# EAGLE design x49_ecu (EAGLE 9.3.1)
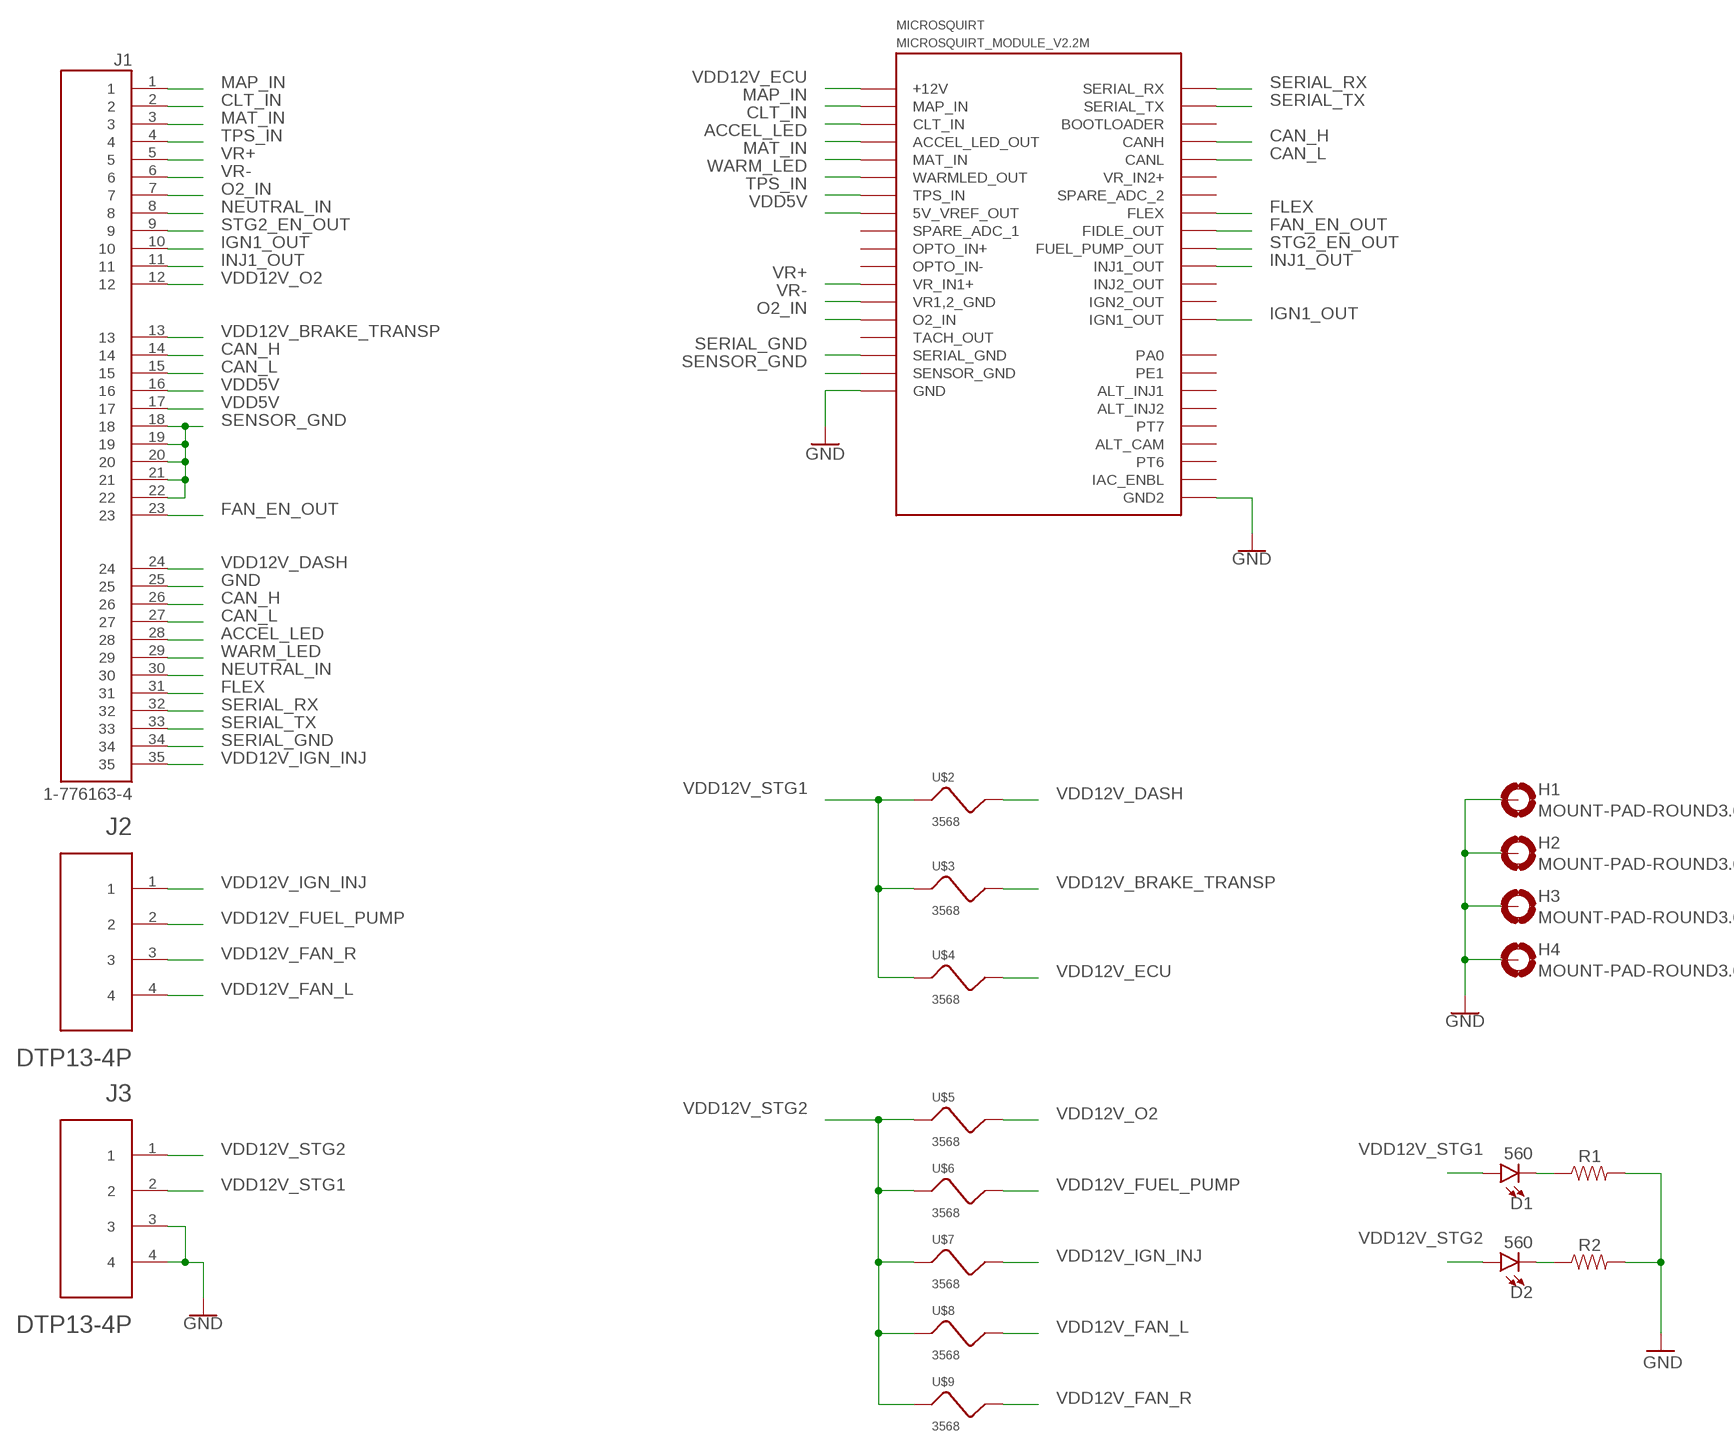
[diagram p0: schematic, sheet 1]

## Parts
D1  560  LED5MM  [LED_5MM]
D2  560  LED5MM  [LED_5MM]
H1  MOUNT-PAD-ROUND3.6  [3,6-PAD]
H2  MOUNT-PAD-ROUND3.6  [3,6-PAD]
H3  MOUNT-PAD-ROUND3.6  [3,6-PAD]
H4  MOUNT-PAD-ROUND3.6  [3,6-PAD]
J1  1-776163-4  [TE_1-776163-4]
J2  DTP13-4P  [TE_DTP13-4P]
J3  DTP13-4P  [TE_DTP13-4P]
MICROSQUIRT  MICROSQUIRT_MODULE_V2.2M  [MICROSQUIRT_MODULE_V2.2M]
R1  RESISTORAXIAL-0.3  [AXIAL-0.3]
R2  RESISTORAXIAL-0.3  [AXIAL-0.3]
U$2  3568  [3568]
U$3  3568  [3568]
U$4  3568  [3568]
U$5  3568  [3568]
U$6  3568  [3568]
U$7  3568  [3568]
U$8  3568  [3568]
U$9  3568  [3568]

## Nets
ACCEL_LED: J1.28 MICROSQUIRT.ACCEL_LED_OUT
CAN_H: J1.14 J1.26 MICROSQUIRT.CANH
CAN_L: J1.15 J1.27 MICROSQUIRT.CANL
CLT_IN: J1.2 MICROSQUIRT.CLT_IN
FAN_EN_OUT: J1.23 MICROSQUIRT.FIDLE_OUT
FLEX: J1.31 MICROSQUIRT.FLEX
GND: H1.B3,6(MOUNT) H2.B3,6(MOUNT) H3.B3,6(MOUNT) H4.B3,6(MOUNT) J1.25 J3.3 J3.4 MICROSQUIRT.GND1_1(GND) MICROSQUIRT.GND1_2(GND) MICROSQUIRT.GND1_3(GND) MICROSQUIRT.GND1_4(GND) MICROSQUIRT.GND1_5(GND) MICROSQUIRT.GND1_6(GND) MICROSQUIRT.GND1_7(GND) MICROSQUIRT.GND1_8(GND) MICROSQUIRT.GND2_1(GND2) MICROSQUIRT.GND2_2(GND2) R1.P$2 R2.P$2
IGN1_OUT: J1.10 MICROSQUIRT.IGN1_OUT_1(IGN1_OUT) MICROSQUIRT.IGN1_OUT_2(IGN1_OUT)
INJ1_OUT: J1.11 MICROSQUIRT.INJ1_OUT_1(INJ1_OUT) MICROSQUIRT.INJ1_OUT_2(INJ1_OUT) MICROSQUIRT.INJ1_OUT_3(INJ1_OUT) MICROSQUIRT.INJ1_OUT_4(INJ1_OUT) MICROSQUIRT.INJ1_OUT_5(INJ1_OUT)
MAP_IN: J1.1 MICROSQUIRT.MAP_IN
MAT_IN: J1.3 MICROSQUIRT.MAT_IN
N$1: D1.K(C) R1.P$1
N$2: D2.K(C) R2.P$1
NEUTRAL_IN: J1.8 J1.30
O2_IN: J1.7 MICROSQUIRT.O2_IN
SENSOR_GND: J1.18 J1.19 J1.20 J1.21 J1.22 MICROSQUIRT.SENSOR_GND
SERIAL_GND: J1.34 MICROSQUIRT.SERIAL_GND
SERIAL_RX: J1.32 MICROSQUIRT.SERIAL_RX
SERIAL_TX: J1.33 MICROSQUIRT.SERIAL_TX
STG2_EN_OUT: J1.9 MICROSQUIRT.FUEL_PUMP_OUT
TPS_IN: J1.4 MICROSQUIRT.TPS_IN
VDD5V: J1.16 J1.17 MICROSQUIRT.5V_VREF_OUT
VDD12V_BRAKE_TRANSP [PWR]: J1.13 U$3.R_1 U$3.R_2
VDD12V_DASH [PWR]: J1.24 U$2.R_1 U$2.R_2
VDD12V_ECU: MICROSQUIRT.+12V_1(+12V) MICROSQUIRT.+12V_2(+12V) U$4.R_1 U$4.R_2
VDD12V_FAN_L: J2.4 U$8.R_1 U$8.R_2
VDD12V_FAN_R: J2.3 U$9.R_1 U$9.R_2
VDD12V_FUEL_PUMP [PWR]: J2.2 U$6.R_1 U$6.R_2
VDD12V_IGN_INJ [PWR]: J1.35 J2.1 U$7.R_1 U$7.R_2
VDD12V_O2 [PWR]: J1.12 U$5.R_1 U$5.R_2
VDD12V_STG1 [PWR]: D1.A J3.2 U$2.L_1 U$2.L_2 U$3.L_1 U$3.L_2 U$4.L_1 U$4.L_2
VDD12V_STG2 [PWR]: D2.A J3.1 U$5.L_1 U$5.L_2 U$6.L_1 U$6.L_2 U$7.L_1 U$7.L_2 U$8.L_1 U$8.L_2 U$9.L_1 U$9.L_2
VR+: J1.5 MICROSQUIRT.VR_IN1+
VR-: J1.6 MICROSQUIRT.VR1,2_GND
WARM_LED: J1.29 MICROSQUIRT.WARMLED_OUT
Unconnected: MICROSQUIRT.ALT_CAM MICROSQUIRT.ALT_INJ1 MICROSQUIRT.ALT_INJ2 MICROSQUIRT.BOOTLOADER MICROSQUIRT.IAC_ENBL MICROSQUIRT.IGN2_OUT_1(IGN2_OUT) MICROSQUIRT.IGN2_OUT_2(IGN2_OUT) MICROSQUIRT.INJ2_OUT_1(INJ2_OUT) MICROSQUIRT.INJ2_OUT_2(INJ2_OUT) MICROSQUIRT.INJ2_OUT_3(INJ2_OUT) MICROSQUIRT.INJ2_OUT_4(INJ2_OUT) MICROSQUIRT.INJ2_OUT_5(INJ2_OUT) MICROSQUIRT.OPTO_IN+ MICROSQUIRT.OPTO_IN- MICROSQUIRT.PA0 MICROSQUIRT.PE1 MICROSQUIRT.PT6 MICROSQUIRT.PT7 MICROSQUIRT.SPARE_ADC_1 MICROSQUIRT.SPARE_ADC_2 MICROSQUIRT.TACH_OUT MICROSQUIRT.VR_IN2+

## Library data of the parts
D1 D2 = SparkFun-LED:LED: LED (Generic) Standard schematic elements and footprints for 5mm, 3mm, 1206, and 0603 sized LEDs. Generic LEDs with no color specified.
H1-H4 = holes:MOUNT-PAD-ROUND: MOUNTING PAD, round
J1 = te_connectivity:1-776163-4: TE Connectivity AMPSEAL 35 POS RTANG HDR ASSY W/GASKET; COMPLIANCE: Lead free/RoHS compliant; CURRENT_RATING: Varies by Wire gauge; DATASHEET: http://www.te.com/commerce/DocumentDelivery/DDEController?Action=srchrtrv&DocNm=776163&DocType=Customer+Drawing&DocLang=English; FOOTPRINT: TE_1-776163-4; LATEST_REV_DATE: 09, March 2016; LIBRARY_REF: 1-776163-4.lbr; MANUFACTURER: TE Connectivity; PACKAGE: Panel Mount, Through Hole, Right angled; PART_DESCRIPTION: CONN HEADER 35POS R/A GOLD GRAY; PART_REV: J8; PITCH: 4mm; POS: 35; STANDARD: Manufacturer Recommendations; TE_PN: 1-776163-4; VOLTAGE_RATING: 250VAC
J2 J3 = te_connectivity:DTP13-4P: TE CONNECTIVITY Dtp Recp 4#12 Pin 90 Deg; AVAILABILITY: In stock; DESCRIPTION: Dtp Recp 4#12 Pin 90 Deg; MF: TE Connectivity; MPN: DTP13-4P; PARTREV: B1; STANDARD: Manufacturer recommendation
MICROSQUIRT = microsquirt:MICROSQUIRT_MODULE_V2.2M: Microsquirt Module V2.2M. This part is a board-mounted card design.
R1 R2 = SparkFun-Resistors:RESISTOR: Generic Resistor Package
U$2-U$9 = keystone_electronics:3568: KEYSTONE ELECTRONICS 3568 ATM FUSE

## Net classes
0 default: clearance 0.205 mm
1 PWR: width 0.508 mm, drill 0.55 mm, clearance 0.205 mm to class 0, clearance 0.205 mm

## Board
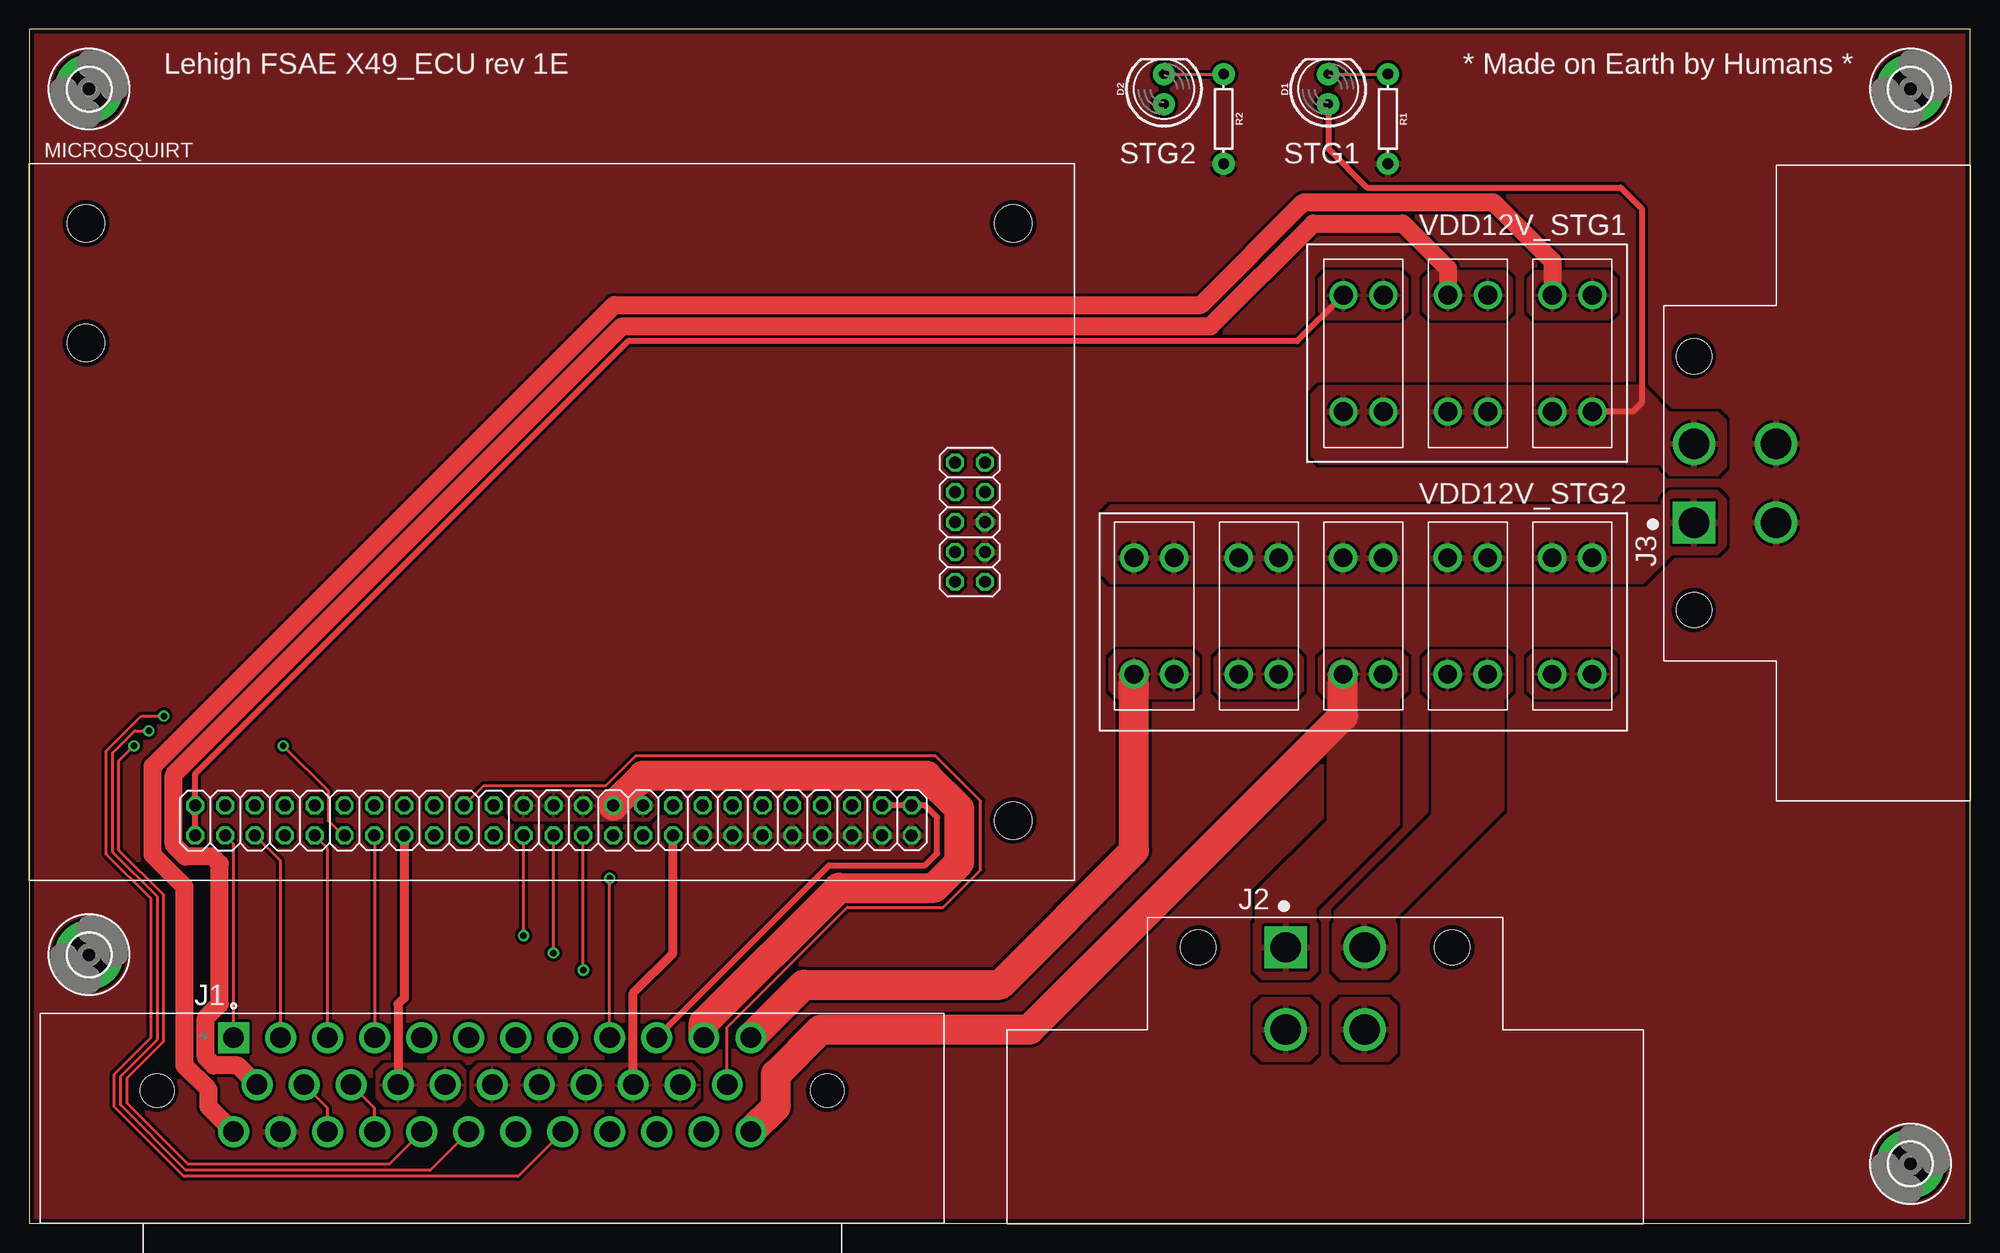
[diagram p1: board, top side]
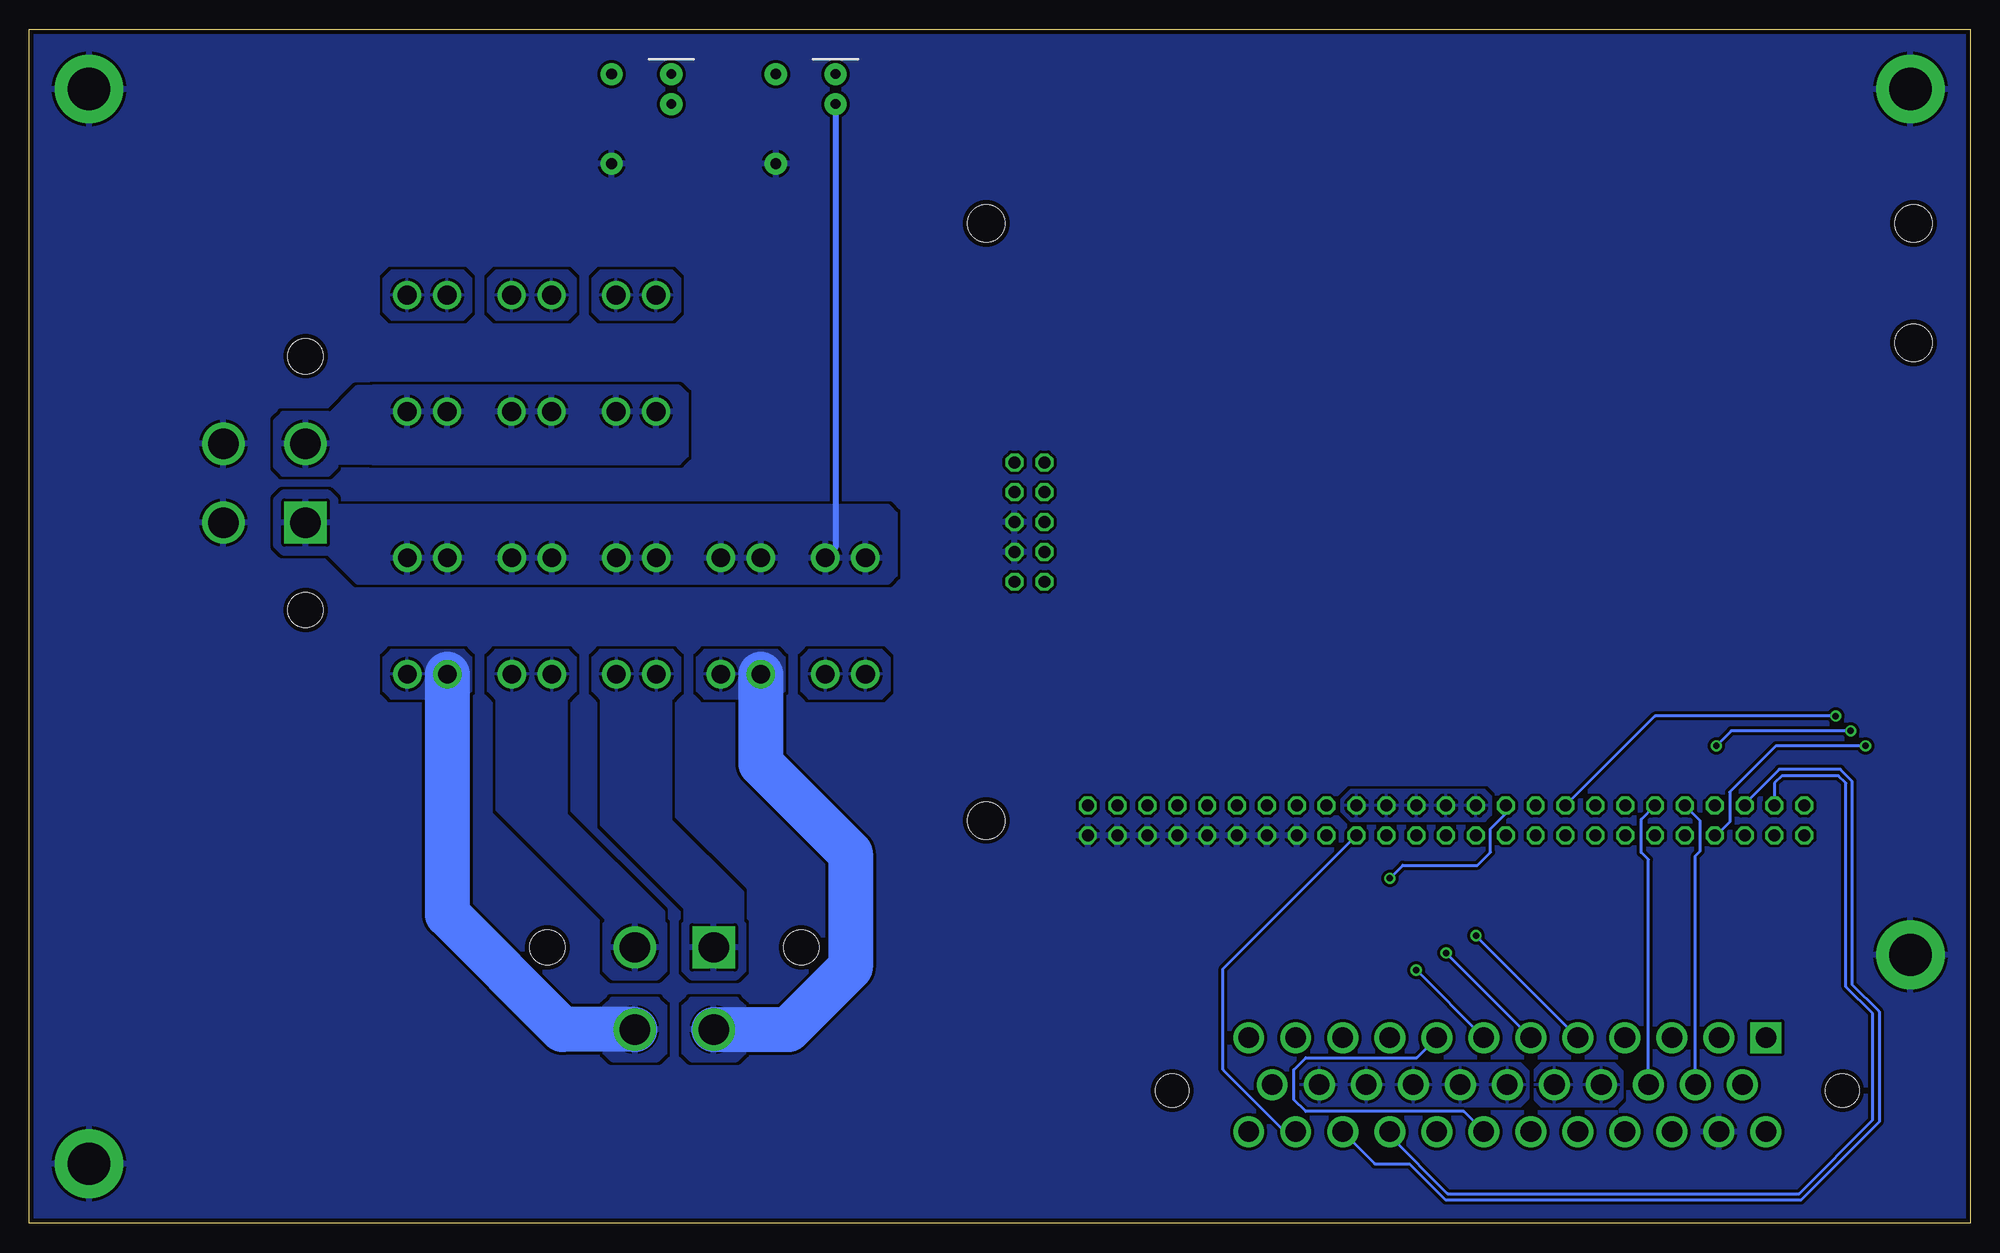
[diagram p2: board, bottom side, seen from below]

Size 165.1 x 101.6 mm. Coordinates in mm from the lower left corner, seen from the top.
Outline: 0,0 165.1,0 165.1,101.6 0,101.6 0,0
Copper layers (1*16): Top 0.035559375mm / dielectric 1.501140625mm / Bottom 0.035559375mm
Design rules "typical_4pcb": minimum track width 10mil, minimum drill 15mil, track to track 6mil, track to pad 6mil, pad to pad 6mil, via to via 6mil, smd to smd 6mil, copper to edge 15mil, drill to drill 8mil, minimum pad ring 10mil, minimum via ring 8mil, stop-mask expansion 4mil, vias tented up to drill 0mil, thermal gap 10mil

### Footprints (pad centres in the part's own frame; a part is rotated, then mirrored left to right if it is on the bottom)
LED_5MM = drill 0.813 pad 1.88: A -1.27,0; K 1.27,0
3,6-PAD = drill 3.6 pad 5.842: B3,6 0,0
TE_1-776163-4 = drill 1.75 square: 1 -22,4 | drill 1.75: 2 -18,4; 3 -14,4; 4 -10,4; 5 -6,4; 6 -2,4; 7 2,4; 8 6,4; 9 10,4; 10 14,4; 11 18,4; 12 22,4; 13 -20,0; 14 -16,0; 15 -12,0; 16 -8,0; 17 -4,0; 18 0,0; 19 4,0; 20 8,0; 21 12,0; 22 16,0; 23 20,0; 24 -22,-4; 25 -18,-4; 26 -14,-4; 27 -10,-4; 28 -6,-4; 29 -2,-4; 30 2,-4; 31 6,-4; 32 10,-4; 33 14,-4; 34 18,-4; 35 22,-4 | hole 2.85: -28.5,-0.5; 28.5,-0.5
TE_DTP13-4P = drill 2.59 square: 1 3.355,0 | drill 2.59: 2 -3.355,0; 3 -3.355,6.99; 4 3.355,6.99 | hole 2.99: -10.795,0; 10.795,0
MICROSQUIRT_MODULE_V2.2M = drill 1.016 octagon: 5V_VREF_OUT 3.807,57.017; +12V_1 3.81,74.803; +12V_2 6.347,74.797; ACCEL_LED_OUT 3.807,67.177; ALT_CAM 33.009,10.152; ALT_INJ1 27.929,10.152; ALT_INJ2 30.469,10.152; BOOTLOADER 6.347,67.177; CANH 6.347,64.637; CANL 6.347,62.097; CLT_IN 3.807,69.717; FIDLE_OUT 6.347,51.937; FLEX 6.347,54.477; FUEL_PUMP_OUT 6.347,49.397; GND1_1 3.807,31.617; GND1_2 3.807,29.077; GND1_3 3.807,26.537; GND1_4 3.807,23.997; GND1_5 3.807,21.457; GND1_6 3.807,18.917; GND1_7 3.807,16.377; GND1_8 3.807,13.837; GND2_1 27.929,7.612; GND2_2 30.469,7.612; IAC_ENBL 35.549,10.152; IGN1_OUT_1 6.347,16.377; IGN1_OUT_2 6.347,13.837; IGN2_OUT_1 6.347,21.457; IGN2_OUT_2 6.347,18.917; INJ1_OUT_1 6.347,46.857; INJ1_OUT_2 6.347,44.317; INJ1_OUT_3 6.347,41.777; INJ1_OUT_4 6.347,39.237; INJ1_OUT_5 6.347,36.697; INJ2_OUT_1 6.347,34.157; INJ2_OUT_2 6.347,31.617; INJ2_OUT_3 6.347,29.077; INJ2_OUT_4 6.347,26.537; INJ2_OUT_5 6.347,23.997; MAP_IN 3.807,72.257; MAT_IN 3.807,64.637; O2_IN 3.807,41.777; OPTO_IN+ 3.807,51.937; OPTO_IN- 3.807,49.397; PA0 25.389,7.612; PE1 25.389,10.152; PT6 35.549,7.612; PT7 33.009,7.612; SENSOR_GND 3.807,34.157; SERIAL_GND 3.807,36.697; SERIAL_RX 6.347,72.257; SERIAL_TX 6.347,69.717; SPARE_ADC_1 3.807,54.477; SPARE_ADC_2 6.347,57.017; TACH_OUT 3.807,39.237; TPS_IN 3.807,59.557; VR1,2_GND 3.807,44.317; VR_IN1+ 3.807,46.857; VR_IN2+ 6.347,59.557; WARMLED_OUT 3.807,62.097 | hole 3.175: 5.08,5.207; 55.88,5.207; 45.72,84.074; 55.88,84.074
AXIAL-0.3 = drill 0.9 pad 1.88: P$1 -3.81,0; P$2 3.81,0
3568 = drill 1.6: L_1 0,0; L_2 0,3.404; R_1 9.906,0; R_2 9.906,3.404

### Placement (x,y rotation side)
D1  110.49,96.52 90 top
D2  96.52,96.52 90 top
H1  5.08,96.52 0 top
H2  160.02,96.52 0 top
H3  5.08,22.86 0 top
H4  160.02,5.08 0 top
J1  39.37,11.81 0 top
J2  110.24,23.5 180 top
J3  141.6,62.99 270 top
MICROSQUIRT  88.9,29.21 90 top
R1  115.57,93.98 270 top
R2  101.6,93.98 270 top
U$2  132.97,69.09 90 top
U$3  124.08,69.09 90 top
U$4  115.19,69.09 90 top
U$5  93.98,56.64 270 top
U$6  120.65,56.64 270 top
U$7  111.76,56.64 270 top
U$8  102.87,56.64 270 top
U$9  129.54,56.64 270 top

### Tracks (layer width: path | path; a pad name or v marks a point on that pad's centre or on a via)
ACCEL_LED  (via drill 0.55)
  Top 0.254: J1.28 30.64,5.08 13.47,5.08 8.3,10.25 8.3,12.38 11.43,15.5 11.43,27.94 7.62,31.75 7.62,39.37 v8.89,40.64
  Bottom 0.254: MICROSQUIRT.ACCEL_LED_OUT 21.59,33.02 20.45,34.16 20.45,36.7 16.51,40.64 v8.89,40.64
CAN_H
  Top 0.254: J1.26 25.37,9.81 J1.14
  Bottom 0.254: J1.14 23.37,31.29 22.97,31.7 22.97,34.26 MICROSQUIRT.CANH
CAN_L
  Top 0.254: J1.27 29.37,9.81 J1.15
  Bottom 0.254: J1.15 27.37,30.97 27.97,31.57 27.97,34.39 MICROSQUIRT.CANL
CLT_IN
  Top 0.254: J1.2 21.37,30.83 MICROSQUIRT.CLT_IN
FAN_EN_OUT
  Top 0.254: J1.23 59.37,16.7 69.57,26.9 77.73,26.9 80.92,30.09 80.92,35.95 77.1,39.78 51.56,39.78 49.06,37.27 38.68,37.27 MICROSQUIRT.FIDLE_OUT
FLEX  (via drill 0.55)
  Top 0.254: J1.31 41.57,4.01 13.13,4.01 7.24,9.91 7.24,12.71 10.36,15.84 10.36,27.6 6.55,31.41 6.55,40.2 9.53,43.18 v11.43,43.18
  Bottom 0.254: v11.43,43.18 26.8,43.18 MICROSQUIRT.FLEX
GND
  pour Top (isolate 0.254, rank 2): -1.27,102.87 166.37,102.87 166.37,-1.27 -1.27,-1.27
  pour Bottom (isolate 0.254, rank 2): -1.27,102.87 166.37,102.87 166.37,-1.27 -1.27,-1.27
IGN1_OUT
  Top 0.508: J1.10 68.04,30.48 76.2,30.48 77.22,31.5 77.22,34.54 76.2,35.56 MICROSQUIRT.IGN1_OUT_2 MICROSQUIRT.IGN1_OUT_1
INJ1_OUT
  Top 2.54: J1.11 57.37,17.08 68.86,28.57 76.96,28.57 79.12,30.73 79.12,35.31 76.33,38.1 52.21,38.1 MICROSQUIRT.INJ1_OUT_4
  pour Bottom: 40.77,34.8 40.77,36.32 41.27,36.83 52.7,36.83 53.47,36.07 53.47,35.05 52.7,34.29 41.27,34.29
  pour Top: 53.47,36.07 53.47,35.05 52.7,34.29 41.27,34.29 40.77,34.8 40.77,36.32 41.27,36.83 52.7,36.83
MAP_IN
  Top 0.254: J1.1 17.37,32.29 MICROSQUIRT.MAP_IN
MAT_IN
  Top 0.254: J1.3 25.37,31.91 MICROSQUIRT.MAT_IN
N$1
  Top 0.254: D1.K R1.P$1
N$2
  Top 0.254: D2.K R2.P$1
NEUTRAL_IN
  Bottom 0.254: J1.30 43.08,9.53 56.52,9.53 57.53,10.54 57.53,13.08 56.52,14.1 47.08,14.1 J1.8
O2_IN  (via drill 0.55)
  Top 0.254: v47.12,21.56 MICROSQUIRT.O2_IN
  Bottom 0.254: J1.7 v47.12,21.56
SENSOR_GND
  Top 0.762: J1.21 51.37,19.62 54.74,22.99 MICROSQUIRT.SENSOR_GND
  pour Top: 38.23,13.59 56.32,13.59 56.96,12.95 56.96,10.67 56.32,10.03 38.23,10.03 37.59,10.67 37.59,12.95
  pour Bottom: 38.23,13.59 56.32,13.59 56.96,12.95 56.96,10.67 56.32,10.03 38.23,10.03 37.59,10.67 37.59,12.95
SERIAL_GND
  Bottom 0.254: J1.34 58.28,7.81 63.55,13.09 63.55,21.67 MICROSQUIRT.SERIAL_GND
SERIAL_RX
  Bottom 0.254: J1.32 49.37,7.46 44.45,2.54 14.54,2.54 8.28,8.8 8.28,17.87 10.57,20.15 10.57,37.47 11.2,38.1 16.01,38.1 16.64,37.47 MICROSQUIRT.SERIAL_RX
SERIAL_TX
  Bottom 0.254: J1.33 50.64,5.08 47.69,5.08 44.62,2.01 14.38,2.01 7.75,8.64 7.75,18.03 10.03,20.32 10.03,37.63 11.03,38.63 16.23,38.63 19.18,35.68 MICROSQUIRT.SERIAL_TX
STG2_EN_OUT  (via drill 0.55)
  Top 0.254: J1.9 v49.37,29.37
  Bottom 0.254: v49.37,29.37 48.26,30.48 41.91,30.48 40.8,31.59 40.8,33.58 39.5,34.87 MICROSQUIRT.FUEL_PUMP_OUT
TPS_IN
  Top 0.254: J1.4 29.37,32.99 MICROSQUIRT.TPS_IN
VDD5V
  Top 0.762: MICROSQUIRT.5V_VREF_OUT 31.88,19.18 31.37,18.67 J1.16
  pour Top: 30.23,13.59 36.51,13.59 37.02,13.08 37.02,10.54 36.51,10.03 30.23,10.03 29.59,10.67 29.59,12.95
  pour Bottom: 30.23,13.59 36.51,13.59 37.02,13.08 37.02,10.54 36.51,10.03 30.23,10.03 29.59,10.67 29.59,12.95
VDD12V_BRAKE_TRANSP
  Top 1.524: J1.13 17.72,13.46 15.68,13.46 15.02,14.12 15.02,17.5 16.2,18.69 16.2,30.61 15.59,31.22 13.28,31.22 12.29,32.2 12.29,38.2 50.44,76.35 100.48,76.35 109.22,85.09 116.84,85.09 120.67,81.25 U$3.R_2
  pour Bottom: 119.25,81.03 125.45,81.03 126.09,80.39 126.09,77.6 125.45,76.96 119.25,76.96 118.62,77.6 118.62,80.39
  pour Top: 119.25,81.03 125.45,81.03 126.09,80.39 126.09,77.6 125.45,76.96 119.25,76.96 118.62,77.6 118.62,80.39
VDD12V_DASH
  Top 1.524: J1.24 15.24,9.94 15.24,11.4 13.21,13.43 13.21,28.66 10.49,31.38 10.49,38.9 49.75,78.16 99.66,78.16 108.4,86.89 124.56,86.89 129.56,81.89 U$2.R_2
  pour Bottom: 128.14,81.03 134.34,81.03 134.98,80.39 134.98,77.6 134.34,76.96 128.14,76.96 127.51,77.6 127.51,80.39
  pour Top: 128.14,81.03 134.34,81.03 134.98,80.39 134.98,77.6 134.34,76.96 128.14,76.96 127.51,77.6 127.51,80.39
VDD12V_ECU
  Top 0.508: MICROSQUIRT.+12V_1 MICROSQUIRT.+12V_2 14.1,38.23 50.93,75.06 107.85,75.06 U$4.R_2
  pour Bottom: 110.36,81.03 116.56,81.03 117.2,80.39 117.2,77.6 116.56,76.96 110.36,76.96 109.73,77.6 109.73,80.39
  pour Top: 110.36,81.03 116.56,81.03 117.2,80.39 117.2,77.6 116.56,76.96 110.36,76.96 109.73,77.6 109.73,80.39
VDD12V_FAN_L
  Bottom 3.81: J2.4 100.53,16.5 95.25,21.79 95.25,31.5 102.87,39.12 U$8.R_1
  pour Top: 108.79,13.97 104.98,13.97 104.34,14.61 104.34,18.41 104.98,19.05 108.79,19.05 109.42,18.41 109.42,14.61
  pour Bottom: 108.79,13.97 104.98,13.97 104.34,14.61 104.34,18.41 104.98,19.05 108.79,19.05 109.42,18.41 109.42,14.61
  pour Top: 101.47,48.77 107.67,48.77 108.31,48.13 108.31,45.34 107.67,44.7 101.47,44.7 100.84,45.34 100.84,48.13
  pour Bottom: 101.47,48.77 107.67,48.77 108.31,48.13 108.31,45.34 107.67,44.7 101.47,44.7 100.84,45.34 100.84,48.13
VDD12V_FAN_R
  Bottom 1.27: J2.3
  Bottom 3.81: J2.3 119.77,16.51 129.54,26.29 U$9.R_1
  pour Top: 116.13,18.41 116.13,14.61 115.5,13.97 111.69,13.97 111.05,14.61 111.05,18.41 111.69,19.05 115.5,19.05
  pour Bottom: 116.13,18.41 116.13,14.61 115.5,13.97 111.69,13.97 111.05,14.61 111.05,18.41 111.69,19.05 115.5,19.05
  pour Top: 128.14,48.77 134.34,48.77 134.98,48.13 134.98,45.34 134.34,44.7 128.14,44.7 127.51,45.34 127.51,48.13
  pour Bottom: 128.14,48.77 134.34,48.77 134.98,48.13 134.98,45.34 134.34,44.7 128.14,44.7 127.51,45.34 127.51,48.13
VDD12V_FUEL_PUMP
  pour Top: 116.13,25.41 116.13,21.59 115.5,20.96 111.69,20.96 111.05,21.59 111.05,25.41 111.69,26.04 115.5,26.04
  pour Bottom: 116.13,25.41 116.13,21.59 115.5,20.96 111.69,20.96 111.05,21.59 111.05,25.41 111.69,26.04 115.5,26.04
  pour Top: 119.25,48.77 125.45,48.77 126.09,48.13 126.09,45.34 125.45,44.7 119.25,44.7 118.62,45.34 118.62,48.13
  pour Bottom: 119.25,48.77 125.45,48.77 126.09,48.13 126.09,45.34 125.45,44.7 119.25,44.7 118.62,45.34 118.62,48.13
  pour Top: 116.08,25.4 111.12,25.4 111.12,26.54 119.38,34.8 119.38,44.96 125.35,44.96 125.35,35.18 116.08,25.91
  pour Bottom: 116.08,25.4 111.12,25.4 111.12,26.54 119.38,34.8 119.38,44.96 125.35,44.96 125.35,35.18 116.08,25.91
VDD12V_IGN_INJ
  Top 2.54: J1.35 63.5,9.94 63.5,12.7 67.31,16.51 85.09,16.51 111.76,43.18 U$7.R_1
  pour Top: 104.34,21.59 104.34,25.41 104.98,26.04 108.79,26.04 109.42,25.41 109.42,21.59 108.79,20.96 104.98,20.96
  pour Bottom: 104.34,21.59 104.34,25.41 104.98,26.04 108.79,26.04 109.42,25.41 109.42,21.59 108.79,20.96 104.98,20.96
  pour Top: 110.36,48.77 116.56,48.77 117.2,48.13 117.2,45.34 116.56,44.7 110.36,44.7 109.73,45.34 109.73,48.13
  pour Bottom: 110.36,48.77 116.56,48.77 117.2,48.13 117.2,45.34 116.56,44.7 110.36,44.7 109.73,45.34 109.73,48.13
  pour Top: 104.39,25.4 104.39,28.19 110.49,34.29 110.49,45.21 116.46,45.21 116.46,33.91 109.35,26.8 109.35,25.4
  pour Bottom: 104.39,25.4 104.39,28.19 110.49,34.29 110.49,45.21 116.46,45.21 116.46,33.91 109.35,26.8 109.35,25.4
VDD12V_O2
  Top 2.54: J1.12 65.88,20.32 82.55,20.32 93.98,31.75 U$5.R_1
  pour Top: 92.58,48.77 98.78,48.77 99.42,48.13 99.42,45.34 98.78,44.7 92.58,44.7 91.95,45.34 91.95,48.13
  pour Bottom: 92.58,48.77 98.78,48.77 99.42,48.13 99.42,45.34 98.78,44.7 92.58,44.7 91.95,45.34 91.95,48.13
VDD12V_STG1
  Top 0.508: D1.A 110.49,91.44 113.79,88.14 135.38,88.14 137.16,86.36 137.16,69.85 136.4,69.09 U$2.L_1
  pour Top: 139.06,64.44 139.06,68.25 139.7,68.89 143.51,68.89 144.15,68.25 144.15,64.44 143.51,63.81 139.7,63.81
  pour Bottom: 139.06,64.44 139.06,68.25 139.7,68.89 143.51,68.89 144.15,68.25 144.15,64.44 143.51,63.81 139.7,63.81
  pour Top: 135.89,64.77 109.86,64.77 109.22,65.41 109.22,70.48 109.86,71.12 135.89,71.12
  pour Top: 135.89,64.77 139.7,64.77 139.7,68.58 137.16,71.12 135.89,71.12
  pour Bottom: 135.89,64.77 109.86,64.77 109.22,65.41 109.22,70.48 109.86,71.12 135.89,71.12
  pour Top: 135.89,64.77 139.7,64.77 139.7,68.58 137.16,71.12 135.89,71.12
  pour Bottom: 135.89,64.77 139.7,64.77 139.7,68.58 137.16,71.12 135.89,71.12
VDD12V_STG2
  Bottom 0.508: D2.A 96.52,57.51 U$5.L_2
  pour Top: 143.51,57.1 139.7,57.1 139.06,57.73 139.06,61.54 139.7,62.18 143.51,62.18 144.15,61.54 144.15,57.73
  pour Bottom: 143.51,57.1 139.7,57.1 139.06,57.73 139.06,61.54 139.7,62.18 143.51,62.18 144.15,61.54 144.15,57.73
  pour Top: 135.89,54.61 92.08,54.61 91.44,55.24 91.44,60.33 92.08,60.96 135.89,60.96
  pour Top: 135.89,60.96 139.7,60.96 139.7,57.15 137.16,54.61 135.89,54.61
  pour Bottom: 135.89,60.96 139.7,60.96 139.7,57.15 137.16,54.61 135.89,54.61
  pour Bottom: 135.89,54.61 92.08,54.61 91.44,55.24 91.44,60.33 92.08,60.96 135.89,60.96
VR+  (via drill 0.55)
  Top 0.254: v42.04,24.48 MICROSQUIRT.VR_IN1+
  Bottom 0.254: J1.5 v42.04,24.48
VR-  (via drill 0.55)
  Top 0.254: v44.58,23.02 MICROSQUIRT.VR1,2_GND
  Bottom 0.254: J1.6 v44.58,23.02
WARM_LED  (via drill 0.55)
  Top 0.254: v21.59,40.64 25.4,36.83 25.4,34.29 26.67,33.02 MICROSQUIRT.WARMLED_OUT | J1.29 34.11,4.55 13.3,4.55 7.77,10.08 7.77,12.54 10.9,15.67 10.9,27.77 7.09,31.58 7.09,40.03 8.96,41.91 v10.16,41.91
  Bottom 0.254: v10.16,41.91 20.32,41.91 v21.59,40.64

### Text on the board
tPlace: Lehigh FSAE X49_ECU rev 1E | * Made on Earth by Humans * | STG2 | STG1 | VDD12V_STG1 | VDD12V_STG2